# EAGLE design WarmDirt (EAGLE 5.11)
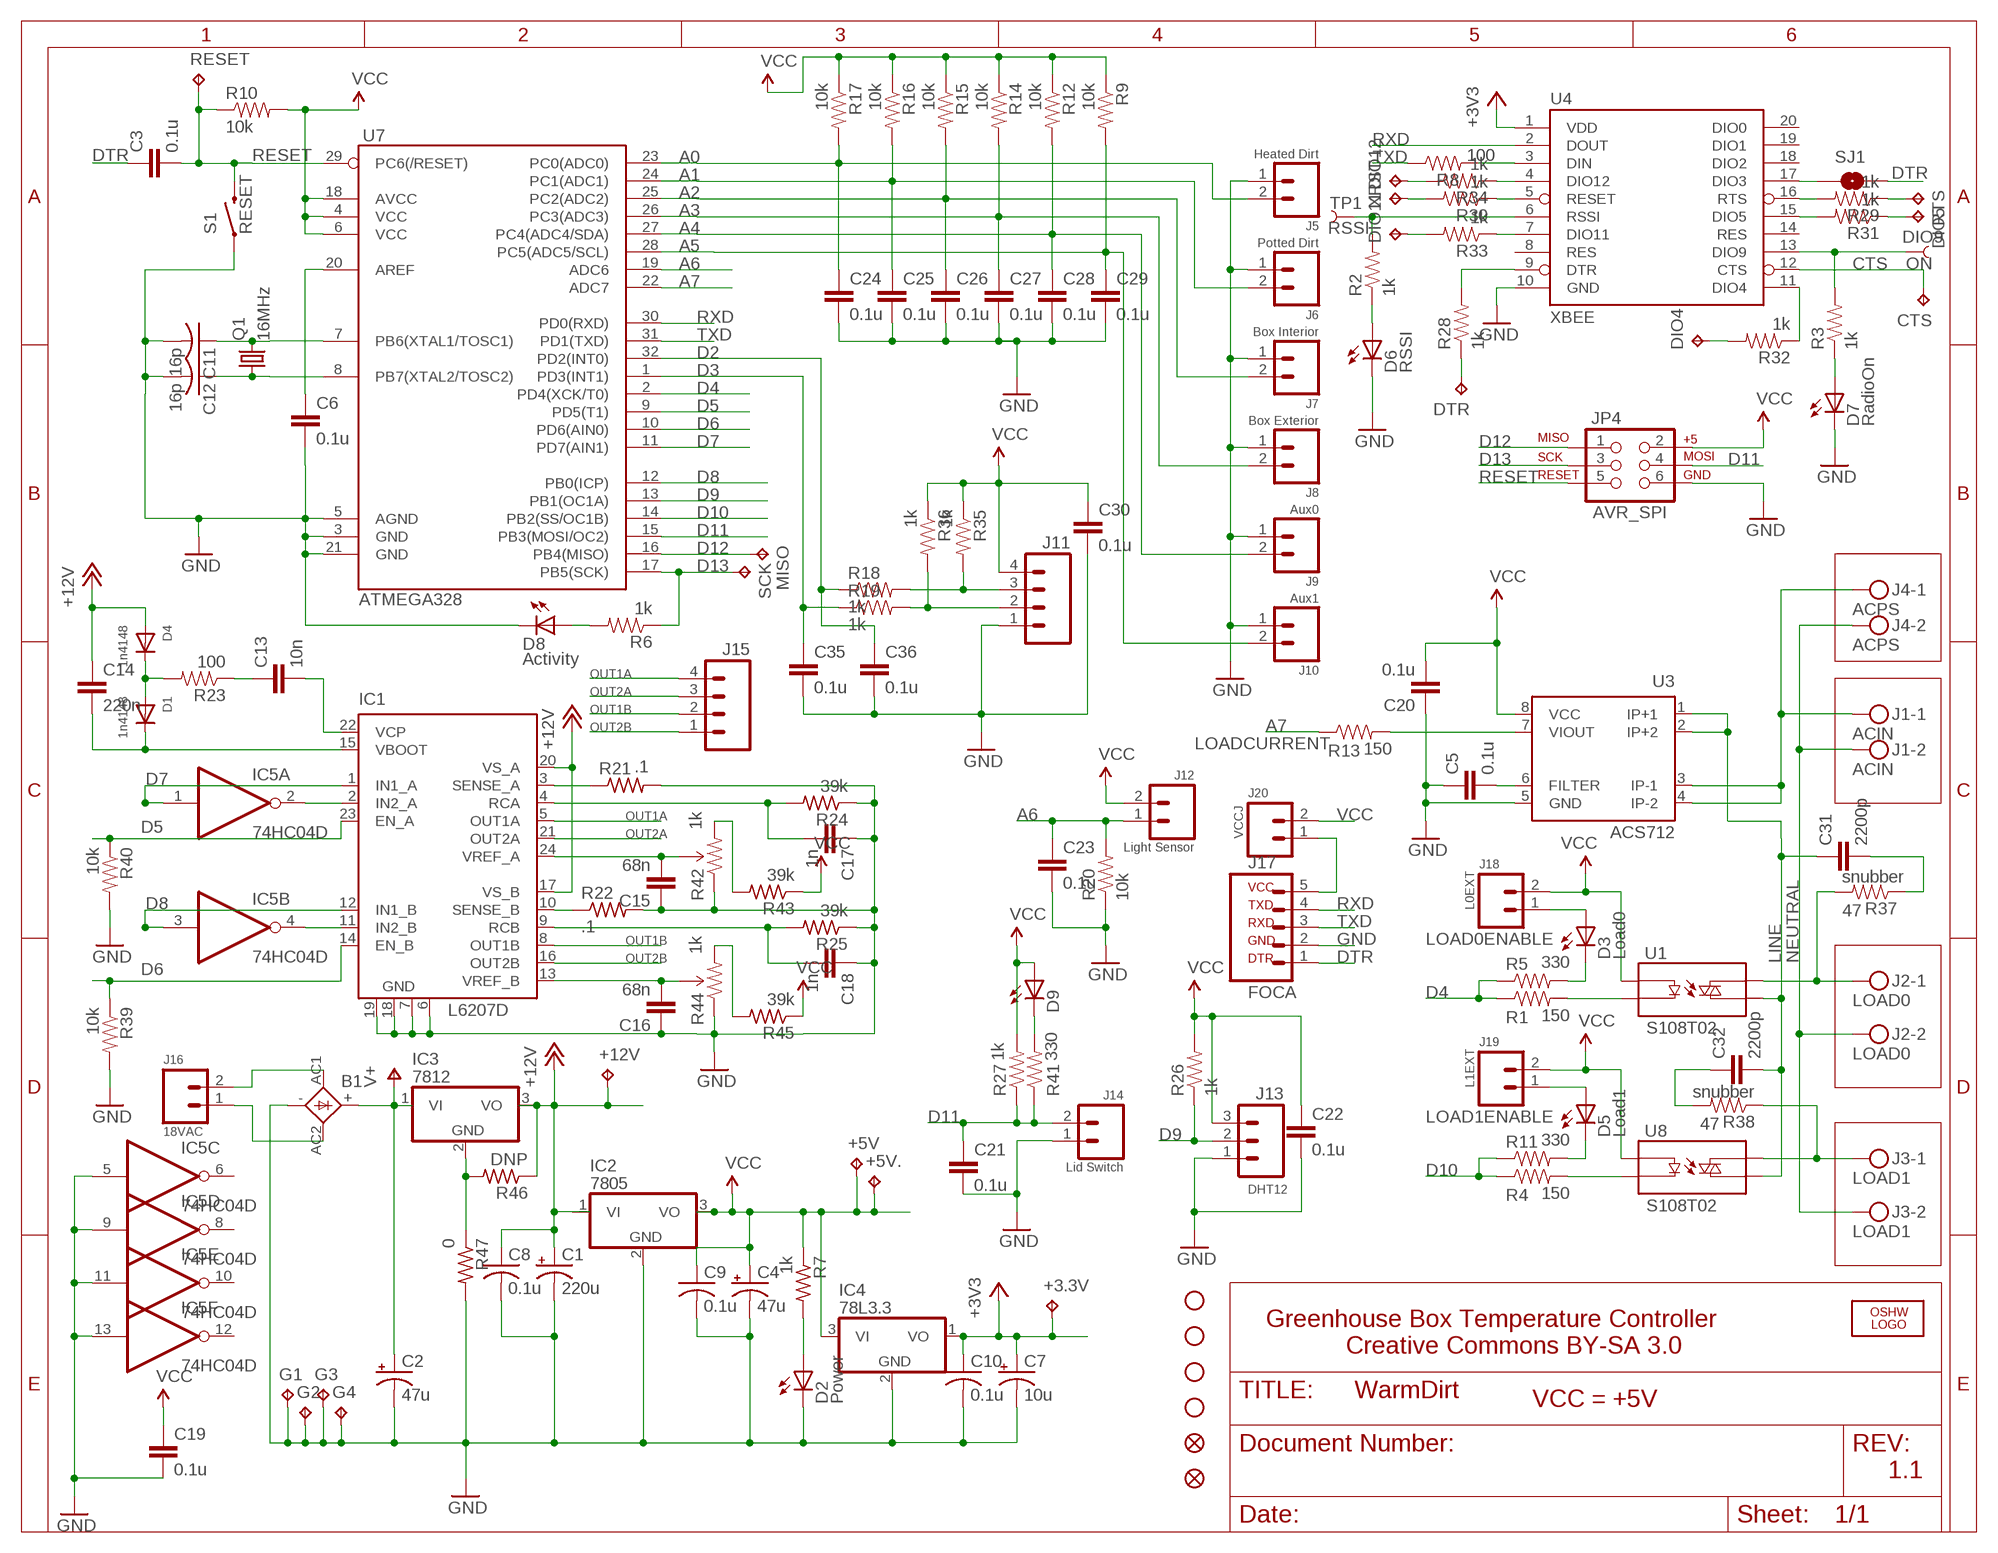
[diagram p0: schematic, sheet 1]

## Parts
+3.3V  TPPAD1-13  [P1-13]
+5V  TPPAD1-13  [P1-13]
+5V.  TPPAD1-13  [P1-13]
+12V  TPPAD1-13  [P1-13]
B1  2KBP  [2KBP]
C1  220u  CPOL-USE3.5-10  [E3,5-10]
C2  47u  CPOL-USE3.5-10  [E3,5-10]
C3  0.1u  CAP0603-CAP  [0603-CAP]
C4  47u  CPOL-USE3.5-10  [E3,5-10]
C5  0.1u  CAP0603-CAP  [0603-CAP]
C6  0.1u  CAP0603-CAP  [0603-CAP]
C7  10u  CPOL-USE2.5-5  [E2,5-5]
C8  0.1u  C-USC0603  [C0603]
C9  0.1u  C-USC0603  [C0603]
C10  0.1u  C-USC0603  [C0603]
C11  16p  C-USC0603  [C0603]
C12  16p  C-USC0603  [C0603]
C13  10n  CAP0603-CAP  [0603-CAP]
C14  220n  CAP0603-CAP  [0603-CAP]
C15  68n  CAP0603-CAP  [0603-CAP]
C16  68n  CAP0603-CAP  [0603-CAP]
C17  1n  CAP0603-CAP  [0603-CAP]
C18  1n  CAP0603-CAP  [0603-CAP]
C19  0.1u  CAP0603-CAP  [0603-CAP]
C20  0.1u  CAP0603-CAP  [0603-CAP]
C21  0.1u  CAP0603-CAP  [0603-CAP]
C22  0.1u  CAP0603-CAP  [0603-CAP]
C23  0.1u  CAP0603-CAP  [0603-CAP]
C24  0.1u  CAP0603-CAP  [0603-CAP]
C25  0.1u  CAP0603-CAP  [0603-CAP]
C26  0.1u  CAP0603-CAP  [0603-CAP]
C27  0.1u  CAP0603-CAP  [0603-CAP]
C28  0.1u  CAP0603-CAP  [0603-CAP]
C29  0.1u  CAP0603-CAP  [0603-CAP]
C30  0.1u  CAP0603-CAP  [0603-CAP]
C31  2200p  CAP0805  [0805]
C32  2200p  CAP0805  [0805]
C35  0.1u  CAP0603-CAP  [0603-CAP]
C36  0.1u  CAP0603-CAP  [0603-CAP]
CTS  TPPAD1-13  [P1-13]
D1  1n4148  DIODESOD-323  [SOD-323]
D2  Power  LEDCHIP-LED0603  [CHIP-LED0603]
D3  Load0  LEDCHIP-LED0603  [CHIP-LED0603]
D4  1n4148  DIODESOD-323  [SOD-323]
D5  Load1  LEDCHIP-LED0603  [CHIP-LED0603]
D6  RSSI  LEDCHIP-LED0603  [CHIP-LED0603]
D7  RadioOn  LEDCHIP-LED0603  [CHIP-LED0603]
D8  Activity  LEDCHIP-LED0603  [CHIP-LED0603]
D9  LEDCHIP-LED0603  [CHIP-LED0603]
DIO4  TPPAD1-13  [P1-13]
DIO5  TPPAD1-13  [P1-13]
DIO9  ON  TEST-POINT3X5  [PAD.03X.05]
DIO11  TPPAD1-13  [P1-13]
DIO12  TPPAD1-13  [P1-13]
DTR  TPPAD1-13  [P1-13]
G1  TPPAD1-13  [P1-13]
G2  TPPAD1-13  [P1-13]
G3  TPPAD1-13  [P1-13]
G4  TPPAD1-13  [P1-13]
IC1  L6207D  [SO24W]
IC2  7805  7805TV  [TO220V]
IC3  7812  7812TV  [TO220V]
IC4  78L3.3  78L05Z  [TO92]
IC5  74HC04D  [SO14]
J1  ACIN  1729128  [MKDSN1,5/2-5,08]
J2  LOAD0  1729128  [MKDSN1,5/2-5,08]
J3  LOAD1  1729128  [MKDSN1,5/2-5,08]
J4  ACPS  1729128  [MKDSN1,5/2-5,08]
J5  Heated Dirt  1984617  [1984617]
J6  Potted Dirt  1984617  [1984617]
J7  Box Interior  1984617  [1984617]
J8  Box Exterior  1984617  [1984617]
J9  Aux0  1984617  [1984617]
J10  Aux1  1984617  [1984617]
J11  Motor Encoder  1984633  [1984633]
J12  Light Sensor  1984617  [1984617]
J13  DHT12  1984620  [1984620]
J14  Lid Switch  1984617  [1984617]
J15  Motor  1984633  [1984633]
J16  18VAC  1984617  [1984617]
J17  FOCA2.1  [FOCA2.1]
J18  L0EXT  M02  [1X02]
J19  L1EXT  M02  [1X02]
J20  VCCJ  M02  [1X02]
JP1  FIDUCIAL1X2  [FIDUCIAL-1X2]
JP2  STAND-OFF  [STAND-OFF]
JP3  STAND-OFF  [STAND-OFF]
JP4  AVR_SPI  AVR_SPI_PRG_62X3_LOCK  [2X3_LOCK]
JP5  STAND-OFF  [STAND-OFF]
JP6  STAND-OFF  [STAND-OFF]
JP7  FIDUCIAL1X2  [FIDUCIAL-1X2]
LOGO1  OSHW_LOGO_FILLX0200-NT  [OSHW_FILLX200_NOTEXT]
MISO  TPPAD1-13  [P1-13]
Q1  16MHz  CRYSTALHC49UP  [HC49UP]
R1  150  RESISTOR0603-RES  [0603-RES]
R2  1k  RESISTOR0603-RES  [0603-RES]
R3  1k  RESISTOR0603-RES  [0603-RES]
R4  150  RESISTOR0603-RES  [0603-RES]
R5  330  RESISTOR0603-RES  [0603-RES]
R6  1k  RESISTOR0603-RES  [0603-RES]
R7  1k  R-US_R0603  [R0603]
R8  100  RESISTOR0603-RES  [0603-RES]
R9  10k  RESISTOR0603-RES  [0603-RES]
R10  10k  RESISTOR0603-RES  [0603-RES]
R11  330  RESISTOR0603-RES  [0603-RES]
R12  10k  RESISTOR0603-RES  [0603-RES]
R13  150  RESISTOR0603-RES  [0603-RES]
R14  10k  RESISTOR0603-RES  [0603-RES]
R15  10k  RESISTOR0603-RES  [0603-RES]
R16  10k  RESISTOR0603-RES  [0603-RES]
R17  10k  RESISTOR0603-RES  [0603-RES]
R18  1k  RESISTOR0603-RES  [0603-RES]
R19  1k  RESISTOR0603-RES  [0603-RES]
R20  10k  RESISTOR0603-RES  [0603-RES]
R21  .1  R-US_R1210  [R1210]
R22  .1  R-US_R1210  [R1210]
R23  100  RESISTOR0603-RES  [0603-RES]
R24  39k  R-US_R0603  [R0603]
R25  39k  R-US_R0603  [R0603]
R26  1k  RESISTOR0603-RES  [0603-RES]
R27  1k  RESISTOR0603-RES  [0603-RES]
R28  1k  RESISTOR0603-RES  [0603-RES]
R29  1k  RESISTOR0603-RES  [0603-RES]
R30  1k  RESISTOR0603-RES  [0603-RES]
R31  1k  RESISTOR0603-RES  [0603-RES]
R32  1k  RESISTOR0603-RES  [0603-RES]
R33  1k  RESISTOR0603-RES  [0603-RES]
R34  1k  RESISTOR0603-RES  [0603-RES]
R35  1k  RESISTOR0603-RES  [0603-RES]
R36  1k  RESISTOR0603-RES  [0603-RES]
R37  47  RESISTOR0603-RES  [0603-RES]
R38  47  RESISTOR0603-RES  [0603-RES]
R39  10k  RESISTOR0603-RES  [0603-RES]
R40  10k  RESISTOR0603-RES  [0603-RES]
R41  330  RESISTOR0603-RES  [0603-RES]
R42  1k  TRIMPOTSMD  [TRIMPOT-3MM]
R43  39k  R-US_R0603  [R0603]
R44  1k  TRIMPOTSMD  [TRIMPOT-3MM]
R45  39k  R-US_R0603  [R0603]
R46  DNP  R-US_R0603  [R0603]
R47  0  R-US_R0603  [R0603]
RESET  TPPAD1-13  [P1-13]
RTS  TPPAD1-13  [P1-13]
S1  RESET  SWITCH-PUSHBUTTON  [TACTILE-SWITCH-6MMX3.5MM]
SCK  TPPAD1-13  [P1-13]
SJ1  SOLDERJUMPERNC  [SJ_2S]
TP1  RSSI  TEST-POINT3X5  [PAD.03X.05]
U1  S108T02  S108T02PTH  [RELAY-S108T02]
U3  ACS712  [SOIC08]
U4  XBEE  XBEE-1B3  [XBEE-SMD]
U7  ATMEGA328  ATMEGA168  [TQFP32-08]
U8  S108T02  S108T02PTH  [RELAY-S108T02]
XRST  TPPAD1-13  [P1-13]

## Nets
+3V3 [VCC]: +3.3V.TP C7.+ C10.1 IC4.1(VO) U4.1(VDD)
+12V: +12V.TP C1.+ C8.1 C14.1 D4.A IC1.17(VS_B) IC1.20(VS_A) IC2.1(VI) IC3.3(VO) R46.1
A0: C24.1 J5.2 R17.2 U7.23(PC0(ADC0))
A1: C25.1 J6.2 R16.2 U7.24(PC1(ADC1))
A2: C26.1 J7.2 R15.2 U7.25(PC2(ADC2))
A3: C27.1 J8.2 R14.2 U7.26(PC3(ADC3))
A4: C28.1 J9.2 R12.2 U7.27(PC4(ADC4/SDA))
A5: C29.1 J10.2 R9.2 U7.28(PC5(ADC5/SCL))
A6: C23.1 J12.1 R20.2 U7.19(ADC6)
A7: R13.1 U7.22(ADC7)
AC1: J1.1 J4.1 U3.3(IP-1) U3.4(IP-2)
AC2: C31.1 C32.2 U1.2(T2) U3.1(IP+1) U3.2(IP+2) U8.2(T2)
AREF: C6.1 U7.20(AREF)
CTS: CTS.TP U4.12(CTS)
D2: C36.1 R18.1 U7.32(PD2(INT0))
D3: C35.1 R19.1 U7.1(PD3(INT1))
D4: R1.1 R5.1 U7.2(PD4(XCK/T0))
D5: IC1.23(EN_A) R40.1 U7.9(PD5(T1))
D6: IC1.14(EN_B) R39.1 U7.10(PD6(AIN0))
D7: IC1.1(IN1_A) IC5.1(A:I) U7.11(PD7(AIN1))
D8: IC1.12(IN1_B) IC5.3(B:I) U7.12(PB0(ICP))
D9: J13.2 R26.1 U7.13(PB1(OC1A))
D10: R4.1 R11.1 U7.14(PB2(SS/OC1B))
D11: C21.1 J14.2 JP4.4 R27.1 R41.1 U7.15(PB3(MOSI/OC2))
D12: JP4.1 MISO.TP U7.16(PB4(MISO))
D13: JP4.3 R6.1 SCK.TP U7.17(PB5(SCK))
DTR: C3.1 J17.1 SJ1.2
GND: B1.- C1.- C2.- C4.- C5.1 C6.2 C7.- C8.2 C9.2 C10.2 C11.2 C12.2 C15.1 C16.1 C17.1 C18.1 C19.2 C20.1 C21.2 C22.2 C23.2 C24.2 C25.2 C26.2 C27.2 C28.2 C29.2 C30.2 C35.2 C36.2 D2.C D6.C D7.C D8.C G1.TP G2.TP G3.TP G4.TP IC1.6(GND) IC1.7(GND) IC1.18(GND) IC1.19(GND) IC2.2(GND) IC4.2(GND) IC5.5(C:I) IC5.9(D:I) IC5.11(E:I) IC5.13(F:I) J5.1 J6.1 J7.1 J8.1 J9.1 J10.1 J11.1 J13.1 J14.1 J17.2 JP4.6 R20.1 R21.2 R22.2 R24.1 R25.1 R39.2 R40.2 R42.1(CCW) R44.1(CCW) R47.2 S1.P$1 U3.5(GND) U4.10(GND) U7.3(GND) U7.5(AGND) U7.21(GND)
N$1: D6.A R2.1
N$2: R2.2 TP1.P$1 U4.6(RSSI)
N$3: B1.AC1 J16.2
N$4: J2.1 R37.2 U1.1(T1)
N$5: D7.A R3.1
N$6: D5.A J19.1
N$7: DIO9.P$1 R3.2 U4.13(DIO9)
N$8: R8.2 U4.3(DIN)
N$9: D3.C R5.2
N$10: D8.A R6.2
N$11: B1.AC2 J16.1
N$12: D2.A R7.2
N$13: SJ1.1 U4.17(DIO3)
N$14: C11.1 Q1.2 U7.7(PB6(XTAL1/TOSC1))
N$15: C12.1 Q1.1 U7.8(PB7(XTAL2/TOSC2))
N$16: IC1.2(IN2_A) IC5.2(A:O)
N$17: IC1.11(IN2_B) IC5.4(B:O)
N$18: D1.A D4.C R23.2
N$19: J3.1 R38.1 U8.1(T1)
N$20: R1.2 U1.4(-)
N$21: J1.2 J2.2 J3.2 J4.2
N$22: IC1.3(SENSE_A) R21.1
N$23: D3.A J18.1
N$24: IC1.10(SENSE_B) R22.1
N$25: R4.2 U8.4(-)
N$26: D5.C R11.2
N$27: C5.2 U3.6(FILTER)
N$28: R13.2 U3.7(VIOUT)
N$29: C14.2 D1.C IC1.15(VBOOT)
N$30: J11.3 R18.2 R35.2
N$31: J11.2 R19.2 R36.2
N$32: C17.2 IC1.4(RCA) R24.2
N$33: C13.1 R23.1
N$34: C13.2 IC1.22(VCP)
N$35: C15.2 IC1.24(VREF_A) R42.2(WIPER)
N$36: C16.2 IC1.13(VREF_B) R44.2(WIPER)
N$37: C18.2 IC1.9(RCB) R25.2
N$39: DTR.TP R28.1
N$40: R29.2 U4.16(RTS)
N$41: R29.1 RTS.TP
N$42: R30.2 XRST.TP
N$43: R30.1 U4.5(RESET)
N$44: DIO12.TP R34.2
N$45: R34.1 U4.4(DIO12)
N$46: R33.1 U4.7(DIO11)
N$47: DIO11.TP R33.2
N$48: R31.2 U4.15(DIO5)
N$49: DIO5.TP R31.1
N$50: R32.1 U4.11(DIO4)
N$51: DIO4.TP R32.2
N$71: C31.2 R37.1
N$92: C32.1 R38.2
N$93: IC3.2(GND) R46.2 R47.1
N$94: D9.C R41.2
N$95: J17.5 J20.1
N$103: R42.3(CW) R43.2
N$104: R44.3(CW) R45.2
OUT1A: IC1.5(OUT1A) J15.4
OUT1B: IC1.8(OUT1B) J15.2
OUT2A: IC1.21(OUT2A) J15.3
OUT2B: IC1.16(OUT2B) J15.1
RESET: C3.2 JP4.5 R10.1 RESET.TP S1.P$2 U7.29(PC6(/RESET))
RXD: J17.4 U4.2(DOUT) U7.30(PD0(RXD))
SLEEP_RQ: R28.2 U4.9(DTR)
TXD: J17.3 R8.1 U7.31(PD1(TXD))
V+: B1.+ C2.+ IC3.1(VI)
VCC: +5V..TP +5V.TP C4.+ C9.1 C19.1 C20.2 C22.1 C30.1 D9.A IC2.3(VO) IC4.3(VI) J11.4 J12.2 J13.3 J18.2 J19.2 J20.2 JP4.2 R7.1 R9.1 R10.2 R12.1 R14.1 R15.1 R16.1 R17.1 R26.2 R27.2 R35.1 R36.1 R43.1 R45.1 U1.3(+) U3.8(VCC) U7.4(VCC) U7.6(VCC) U7.18(AVCC) U8.3(+)
Unconnected: IC5.6(C:O) IC5.8(D:O) IC5.10(E:O) IC5.12(F:O) U4.8(RES) U4.14(RES) U4.18(DIO2) U4.19(DIO1) U4.20(DIO0)

## Notes on the sheet
- LOADCURRENT
- snubber
- LOAD0ENABLE
- LINE | NEUTRAL
- snubber
- LOAD1ENABLE
- DHT12
- Greenhouse Box Temperature Controller
- Creative Commons BY-SA 3.0
- VCC = +5V
- 1.1

## Power pins joined to a net without a drawn wire
GND: IC5.7(P:GND)
VCC: IC5.14(P:VCC)

## Library data of the parts
+3.3V +5V +5V. +12V CTS DIO4 DIO5 DIO11 DIO12 DTR G1-G4 MISO RESET RTS SCK XRST = testpad:TP: Test pad
B1 = rectifier:2KBP: RECTIFIER grid 3 x 3,81 mm
C1 C2 C4 C7 = rcl:CPOL-US: POLARIZED CAPACITOR, American symbol
C3 C5 C6 C13-C32 C35 C36 = SparkFun:CAP: Capacitor Standard 0603 ceramic capacitor, and 0.1" leaded capacitor.
C8-C12 = rcl:C-US: CAPACITOR, American symbol
D1 D4 = adafruit-2a72e41:DIODE: Diode SMADIODE - SMA Surface Mount Package 20V 1A Schottky Diode Digikey: 641-1014-6-ND DO-1N4148 - Through Hole Small Current Diode SOD-123 20V 1 A (.5mV Vf) Schottky Diode - Digikey: MBRX120TPMSCT-ND SOD-323 10V 570mA (.38mV Vf, 3ns) Schottky Diode - Digikey: ZLLS410CT-ND SOD-523 30V 30mA Schottky Diode (RB751S-40TE61) - Digikey: RB751S-40TE61CT-ND SOT23-R/W - SOT23 Package (R = Solder Paste/Reflow Ovens, W = Hand-Soldering) BAT54Film 40V 300mA - Digikey: 497-7162-1-ND
D2 D3 D5-D9 = led:LED: LED OSRAM: - CHIPLED LG R971, LG N971, LY N971, LG Q971, LY Q971, LO R971, LY R971 LH N974, LH R974 LS Q976, LO Q976, LY Q976 LO Q996 - Hyper CHIPLED LW Q18S LB Q993, LB Q99A, LB R99A - SideLED LS A670, LO A670, LY A670, LG A670, LP A670 LB A673, LV A673, LT A673, LW A673 LH A674 LY A675 LS A676, LA A676, LO A676, LY A676, LW A676 LS A679, LY A679, LG A679 - Hyper Micro SIDELED® LS Y876, LA Y876, LO Y876, LY Y876 LT Y87S - SmartLED LW L88C, LW L88S LB L89C, LB L89S, LG L890 LS L89K, LO L89K, LY L89K LS L896, LA L896, LO L896, LY L896 - TOPLED LS T670, LO T670, LY T670, LG T670, LP T670 LSG T670, LSP T670, LSY T670, LOP T670, LYG T670 LG T671, LOG T671, LSG T671 LB T673, LV T673, LT T673, LW T673 LH T674 LS T676, LA T676, LO T676, LY T676, LB T676, LH T676, LSB T676, LW T676 LB T67C, LV T67C, LT T67C, LS T67K, LO T67K, LY T67K, LW E67C LS E67B, LA E67B, LO E67B, LY E67B, LB E67C, LV E67C, LT E67C LW T67C LS T679, LY T679, LG T679 LS T770, LO T770, LY T770, LG T770, LP T770 LB T773, LV T773, LT T773, LW T773 LH T774 LS E675, LA E675, LY E675, LS T675 LS T776, LA T776, LO T776, LY T776, LB T776 LHGB T686 LT T68C, LB T68C - Hyper Mini TOPLED® LB M676 - Mini TOPLED Santana® LG M470 LS M47K, LO M47K, LY M47K Source: http://www.osram.convergy.de LUXEON: - LUMILED® LXK2-PW12-R00, LXK2-PW12-S00, LXK2-PW14-U00, LXK2-PW14-V00 LXK2-PM12-R00, LXK2-PM12-S00, LXK2-PM14-U00 LXK2-PE12-Q00, LXK2-PE12-R00, LXK2-PE12-S00, LXK2-PE14-T00, LXK2-PE14-U00 LXK2-PB12-K00, LXK2-PB12-L00, LXK2-PB12-M00, LXK2-PB14-N00, LXK2-PB14-P00, LXK2-PB14-Q00 LXK2-PR12-L00, LXK2-PR12-M00, LXK2-PR14-Q00, LXK2-PR14-R00 LXK2-PD12-Q00, LXK2-PD12-R00, LXK2-PD12-S00 LXK2-PH12-R00, LXK2-PH12-S00 LXK2-PL12-P00, LXK2-PL12-Q00, LXK2-PL12-R00 Source: www.luxeon.com KINGBRIGHT: KA-3528ASYC Source: www.kingbright.com
DIO9 TP1 = SparkFun:TEST-POINT
IC1 = st-microelectronics:L6207: DUAL DMOS FULL BRIDGE MOTOR DRIVER; MPN: L6207D; OC_FARNELL: unknown; OC_NEWARK: 42M9976
IC2-IC4 = linear:78*: Positive VOLTAGE REGULATOR Source: http://cache.national.com/ds/LM/LM78L05.pdf http://www.fairchildsemi.com/ds/LM/LM7805.pdf
IC5 = 74xx-eu:74*04: Hex INVERTER
J1-J4 = brightleaf:1729128: Phoenix Contact CONN TERM BLOCK 3POS 5.08MM PCB Printklemme Nennstrom: 13,5 A Nennspannung: 250 V Rastermaß: 5,08 mm Polzahl: 2 Anschlussart: Schraubanschluss Montage: Löten Anschlussrichtung Leiter/Platine: 0 ° Artikelnummer: 1729128 Source: http://eshop.phoenixcontact.com .. 1729128.pdf; MPN: MKDSN 1,5/2-5.08; OC_FARNELL: 1792903; OC_NEWARK: 30M2397
J5-J10 J12 J14 J16 = brightleaf:1984617: Phoenix Contact CONN TERM BLOCK T/H 2POS 3.5MM
J11 J15 = brightleaf:1984633: Phoenix Contact CONN TERM BLOCK T/H 4POS 3.5MM
J13 = brightleaf:1984620: Phoenix Contact CONN TERM BLOCK T/H 3POS 3.5MM
J17 = brightleaf:FOCA2.1: FOCA 2.1 iteadstudio Foca v2.1 Foca is a FT232RL breakout. The FT232RL is a USB to serial UART interface with optional clock generator output. It?s the essential tools for establishing communication between PC and mostly MCU. Especially, it?s the optimum tool for the board which basic Arduino but without USB interface,like Sniffer Nano , Colorduino and etc.
J18-J20 = brightleaf:M02
JP1 JP7 = SparkFun:FIDUCIAL: Fiducial Alignment Points Various fiducial points for machine vision alignment.
JP2 JP3 JP5 JP6 = SparkFun:STAND-OFF: Stand Off This is the mechanical footprint for a #4 phillips button head screw. Use the keepout ring to avoid running the screw head into surrounding components. SKU : PRT-00447
JP4 = SparkFun:AVR_SPI_PRG_6: AVR ISP 6 Pin This is the reduced ISP connector for AVR programming. Common on Arduino. This footprint will take up less PCB space and can be used with a 10-pin to 6-pin adapter such as SKU: BOB-08508
LOGO1 = ohw-logo:OSHW_LOGO_FILL
Q1 = crystal:CRYSTAL: CRYSTAL; OC_FARNELL: unknown; OC_NEWARK: unknown
R1-R6 R8-R20 R23 R26-R41 = SparkFun:RESISTOR: Resistor Basic schematic elements and footprints for 0603, 1206, and PTH resistors.
R7 = resistor:R-US_: RESISTOR, American symbol
R21 R22 R24 R25 R43 R45-R47 = rcl:R-US_: RESISTOR, American symbol
R42 R44 = SparkFun:TRIMPOT
S1 = brightleaf:SWITCH-PUSHBUTTON
SJ1 = SparkFun:SOLDERJUMPER: Solder Jumper Standard SMD solder jumper. Used to automate production. Two varients : Normally Open and Normally Closed are the same, but have different paste layers. NC will have a large amount of paste and should jumper during reflow.
U1 U8 = brightleaf:S108T02
U3 = brightleaf:ACS712: Fully Integrated, Hall Effect-Based Linear Current Sensor IC with 2.1 kVRMS Isolation and a Low-Resistance Current Conductor
U4 = SparkFun:XBEE-1
U7 = SparkFun:ATMEGA168

## Net classes
0 default: width 0.203 mm
1 VCC: width 0.381 mm

## Board
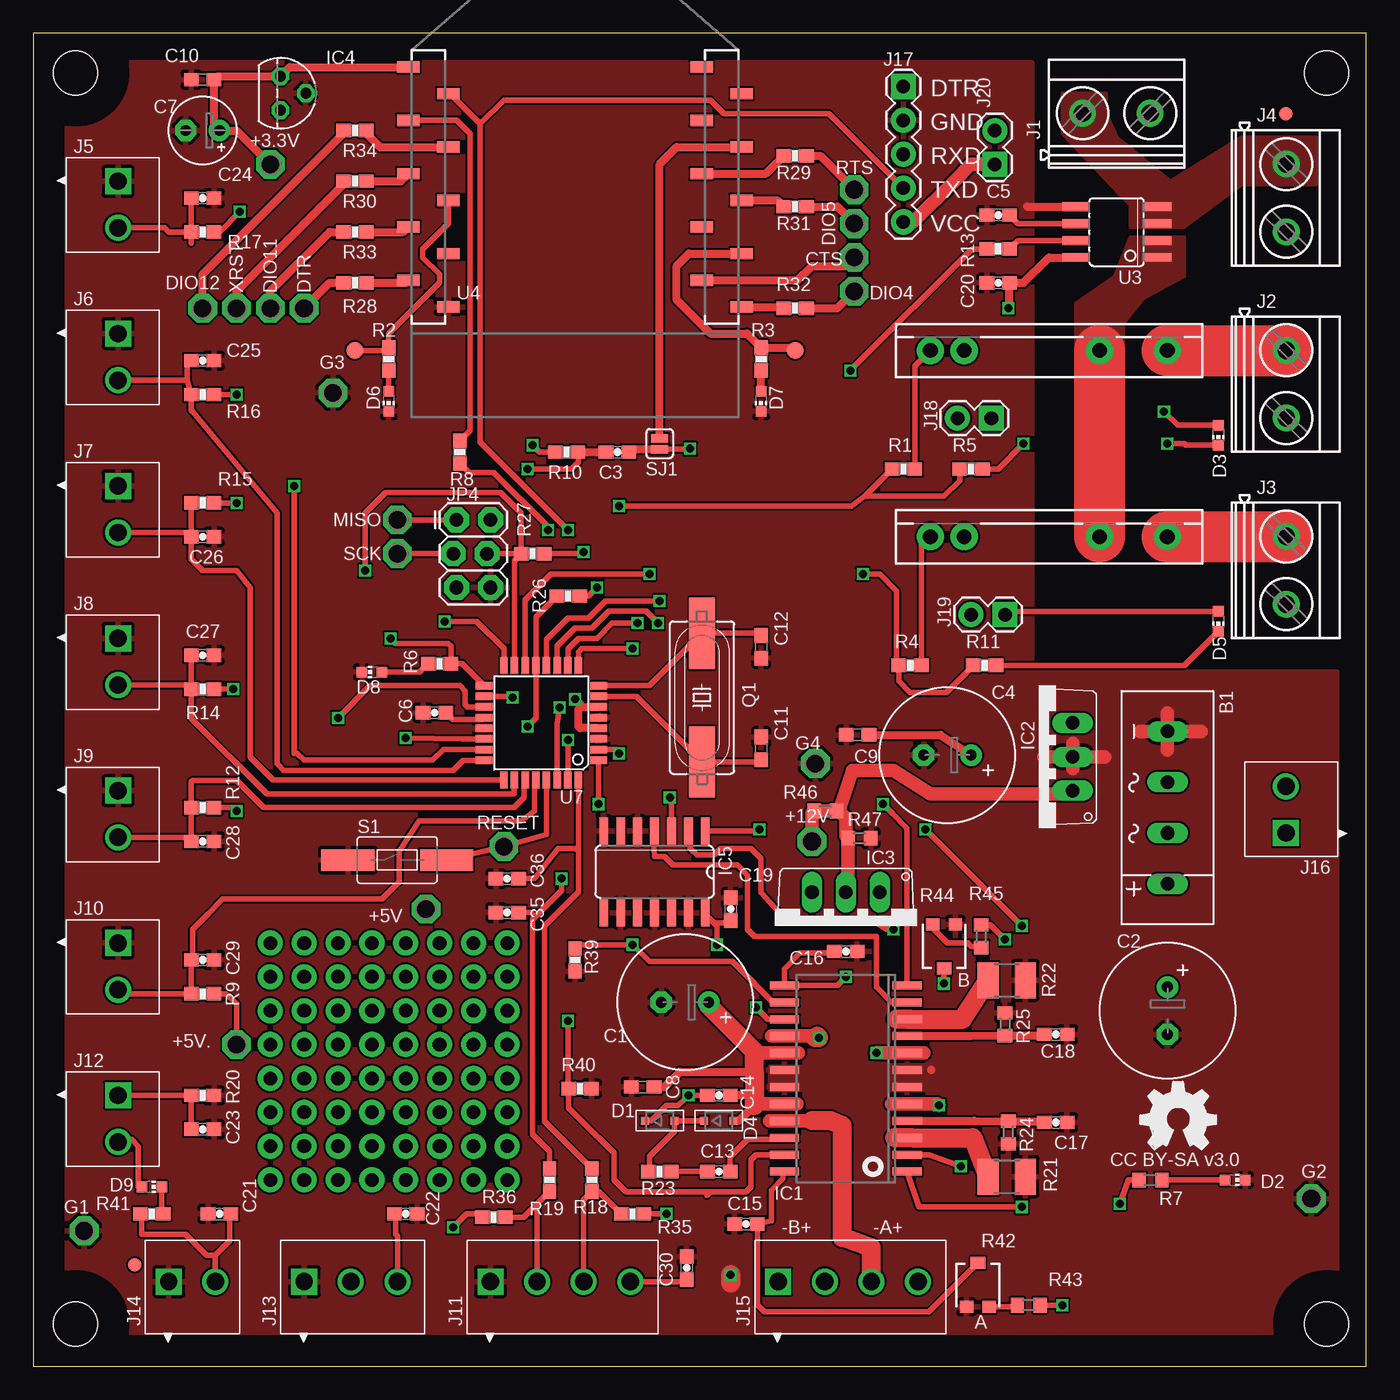
[diagram p1: board, top side]
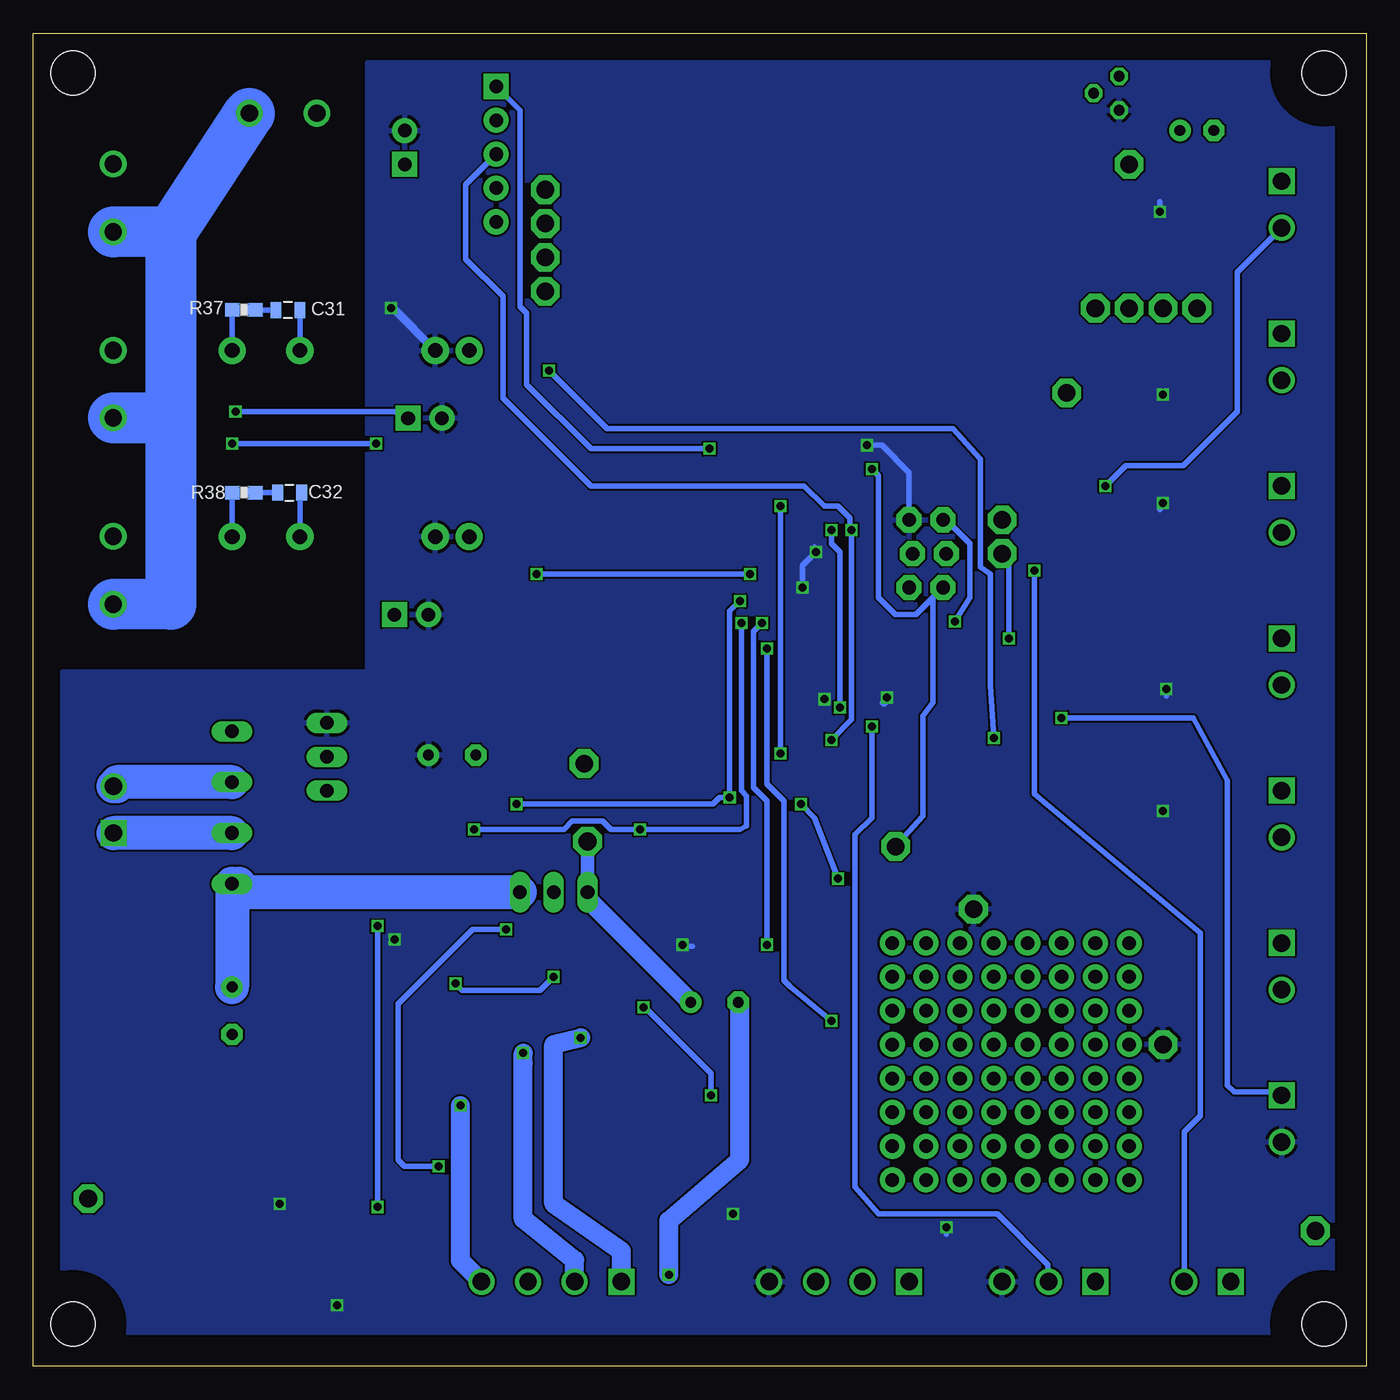
[diagram p2: board, bottom side, seen from below]

Size 100 x 100 mm. Coordinates in mm from the lower left corner, seen from the top.
Outline: 0,0 100,0 100,100 0,100 0,0
Copper layers (1*16): Top 0.035mm / dielectric 1.5mm / Bottom 0.035mm
Design rules "ITead_rule": minimum track width 6mil, minimum drill 12mil, track to track 6mil, track to pad 6mil, pad to pad 6mil, via to via 6mil, smd to smd 0mil, copper to edge 10mil, drill to drill 10mil, minimum pad ring 10mil, minimum via ring 6mil, stop-mask expansion 2mil, vias tented up to drill 100mil, thermal gap 10mil
tKeepout: area 93.2,93.2 to 100.8,100.8
tRestrict: area 34.5,44.7 to 41.7,51.8; area 93.2,-0.6 to 100.8,7; area -0.6,-0.6 to 7,7; area -0.6,93.2 to 7,100.8
bRestrict: area 93.2,-0.6 to 100.8,7; area -0.6,-0.6 to 7,7; area -0.6,93.2 to 7,100.8

### Footprints (pad centres in the part's own frame; a part is rotated, then mirrored left to right if it is on the bottom)
P1-13 = drill 1.321 pad 2.159 octagon: TP 0,0
2KBP = drill 1.016 long: + 5.715,0; - -5.715,0; AC1 -1.905,0; AC2 1.905,0
E3,5-10 = drill 0.813 pad 1.6 round: + -1.778,0 | drill 0.813 pad 1.6 octagon: - 1.778,0
0603-CAP = smd 1.1 x 1: 1 -0.85,0; 2 0.85,0
E2,5-5 = drill 0.813 pad 1.6 round: + -1.27,0 | drill 0.813 pad 1.6 octagon: - 1.27,0
C0603 = smd 1.1 x 1: 1 -0.85,0; 2 0.85,0
0805 = smd 0.8 x 1.2: 1 -0.9,0; 2 0.9,0
SOD-323 = smd 0.6 x 0.6: A 1.1,0; C -1.1,0
CHIP-LED0603 = smd 0.8 x 0.8: A 0,-0.75; C 0,0.75
PAD.03X.05 = smd 1.27 x 1.27: P$1 0,0
SO24W = smd 0.6 x 2.2: 1 -6.985,-4.6; 2 -5.715,-4.6; 3 -4.445,-4.6; 4 -3.175,-4.6; 5 -1.905,-4.6; 6 -0.635,-4.6; 7 0.635,-4.6; 8 1.905,-4.6; 9 3.175,-4.6; 10 4.445,-4.6; 11 5.715,-4.6; 12 6.985,-4.6; 13 6.985,4.6; 14 5.715,4.6; 15 4.445,4.6; 16 3.175,4.6; 17 1.905,4.6; 18 0.635,4.6; 19 -0.635,4.6; 20 -1.905,4.6; 21 -3.175,4.6; 22 -4.445,4.6; 23 -5.715,4.6; 24 -6.985,4.6
TO220V = drill 1.016 long: 1 -2.54,-2.54; 2 0,-2.54; 3 2.54,-2.54
TO92 = drill 0.813 octagon: 1 -1.27,0; 2 0,1.905; 3 1.27,0
SO14 = smd 0.66 x 2.032: 1 -3.81,-3.073; 2 -2.54,-3.073; 3 -1.27,-3.073; 4 0,-3.073; 5 1.27,-3.073; 6 2.54,-3.073; 7 3.81,-3.073; 8 3.81,3.073; 9 2.54,3.073; 10 1.27,3.073; 11 0,3.073; 12 -1.27,3.073; 13 -2.54,3.073; 14 -3.81,3.073
MKDSN1,5/2-5,08 = drill 1.3 pad 2 round: 1 -2.561,0.025; 2 2.519,0.025
1984617 = drill 1.3 square: 1 0,0 | drill 1.3 round: 2 3.5,0
1984633 = drill 1.3 square: 1 0,0 | drill 1.3 round: 2 3.5,0; 3 7,0; 4 10.5,0
1984620 = drill 1.3 square: 1 0,0 | drill 1.3 round: 2 3.5,0; 3 7,0
FOCA2.1 = drill 1.016 pad 1.88 square: 1 0,0 | drill 1.016 pad 1.88 round: 2 2.54,0; 3 5.08,0; 4 7.62,0; 5 10.16,0
1X02 = drill 1.016 pad 1.88 square: 1 0,0 | drill 1.016 pad 1.88 round: 2 2.54,0
FIDUCIAL-1X2 = smd 1 x 1: 1 0,0
STAND-OFF = hole 3.302: 0,0
2X3_LOCK = drill 1.016 pad 1.88 octagon: 1 0,0; 2 0,2.54; 3 2.54,-0.254; 4 2.54,2.286; 5 5.08,0; 6 5.08,2.54
HC49UP = smd 5.334 x 1.93: 1 -4.826,0; 2 4.826,0
0603-RES = smd 1.1 x 1: 1 -0.85,0; 2 0.85,0
R0603 = smd 1 x 1.1: 1 -0.85,0; 2 0.85,0
R1210 = smd 1.6 x 2.7: 1 -1.4,0; 2 1.4,0
TRIMPOT-3MM = smd 1 x 0.9: 1 -0.85,-1.65; 3 0.85,-1.65 | smd 1.1 x 0.9: 2 0,1.65
TACTILE-SWITCH-6MMX3.5MM = smd 4 x 1.6: P$1 -3.7,0; P$2 3.7,0
SJ_2S = smd 0.635 x 1.27: 1 -0.412,0; 2 0.412,0
RELAY-S108T02 = drill 1.1 pad 2.032 round: 1 -8.88,0; 2 -3.8,0; 3 6.36,0; 4 8.9,0
SOIC08 = smd 0.66 x 2.032: 1 -1.905,-3.073; 2 -0.635,-3.073; 3 0.635,-3.073; 4 1.905,-3.073; 5 1.905,3.073; 6 0.635,3.073; 7 -0.635,3.073; 8 -1.905,3.073
XBEE-SMD = smd 1.7 x 0.85: 1 -12.5,20; 2 -9.5,18; 3 -12.5,16; 4 -9.5,14; 5 -12.5,12; 6 -9.5,10; 7 -12.5,8; 8 -9.5,6; 9 -12.5,4; 10 -9.5,2; 11 12.5,2; 12 9.5,4; 13 12.5,6; 14 9.5,8; 15 12.5,10; 16 9.5,12; 17 12.5,14; 18 9.5,16; 19 12.5,18; 20 9.5,20
TQFP32-08 = smd 1.27 x 0.559: 1 -4.293,2.8; 2 -4.293,2; 3 -4.293,1.2; 4 -4.293,0.4; 5 -4.293,-0.4; 6 -4.293,-1.2; 7 -4.293,-2; 8 -4.293,-2.8; 17 4.293,-2.8; 18 4.293,-2; 19 4.293,-1.2; 20 4.293,-0.4; 21 4.293,0.4; 22 4.293,1.2; 23 4.293,2; 24 4.293,2.8 | smd 0.559 x 1.27: 9 -2.8,-4.293; 10 -2,-4.293; 11 -1.2,-4.293; 12 -0.4,-4.293; 13 0.4,-4.293; 14 1.2,-4.293; 15 2,-4.293; 16 2.8,-4.293; 25 2.8,4.293; 26 2,4.293; 27 1.2,4.293; 28 0.4,4.293; 29 -0.4,4.293; 30 -1.2,4.293; 31 -2,4.293; 32 -2.8,4.293

### Placement (x,y rotation side)
+3.3V  17.78,90.17 0 top
+5V  29.46,34.29 0 top
+5V.  15.24,24.13 0 top
+12V  58.42,39.37 0 top
B1  85.09,41.91 270 top
C1  48.9,27.3 180 top
C2  85.09,26.67 270 top
C3  43.81,68.58 180 top
C4  68.58,45.85 180 top
C5  72.39,86.36 0 top
C6  30.1,49.02 180 top
C7  12.7,92.71 180 top
C8  45.72,20.95 180 top
C9  61.85,47.37 180 top
C10  12.7,96.52 180 top
C11  54.61,46.35 90 top
C12  54.61,53.98 270 top
C13  51.44,14.61 0 top
C14  51.44,20.32 180 top
C15  53.47,10.67 0 top
C16  60.96,31.11 180 top
C17  76.71,18.29 180 top
C18  76.71,24.89 180 top
C19  52.32,34.29 90 top
C20  72.39,81.28 0 top
C21  13.97,11.43 180 top
C22  27.94,11.43 0 top
C23  12.7,17.78 0 top
C24  12.7,87.63 0 top
C25  12.7,75.44 0 top
C26  12.7,62.23 0 top
C27  12.7,53.34 0 top
C28  12.7,39.37 0 top
C29  12.7,30.48 0 top
C30  49.02,7.37 90 top
C31  80.9,79.25 180 bottom
C32  80.77,65.53 0 bottom
C35  35.56,34.04 180 top
C36  35.56,36.58 180 top
CTS  61.59,83.19 90 top
D1  46.99,18.41 0 top
D2  90.17,13.97 270 top
D3  88.9,69.85 180 top
D4  51.44,18.41 0 top
D5  88.9,55.88 180 top
D6  26.67,72.39 180 top
D7  54.61,72.39 180 top
D8  25.4,52.07 90 top
D9  8.89,13.46 270 top
DIO4  61.59,80.64 90 top
DIO5  61.59,85.72 90 top
DIO9  57.15,76.2 0 top
DIO11  17.78,79.38 90 top
DIO12  12.7,79.38 90 top
DTR  20.32,79.38 180 top
G1  3.81,10.16 0 top
G2  95.89,12.57 0 top
G3  22.48,73.03 0 top
G4  58.67,45.21 0 top
IC1  60.96,21.59 90 top
IC2  75.44,45.72 90 top
IC3  60.96,33.02 180 top
IC4  18.54,95.5 270 top
IC5  46.61,37.08 180 top
J1  81.28,93.98 0 top
J2  93.98,73.66 270 top
J3  93.98,59.69 270 top
J4  93.98,87.63 270 top
J5  6.35,88.9 270 top
J6  6.35,77.47 270 top
J7  6.35,66.04 270 top
J8  6.35,54.61 270 top
J9  6.35,43.18 270 top
J10  6.35,31.75 270 top
J11  34.29,6.35 0 top
J12  6.35,20.32 270 top
J13  20.32,6.35 0 top
J14  10.16,6.35 0 top
J15  55.88,6.35 0 top
J16  93.98,40.01 90 top
J17  65.28,96.01 270 top
J18  71.88,71.12 180 top
J19  72.9,56.39 180 top
J20  72.14,90.17 90 top
JP1  7.62,7.62 0 top
JP2  97.03,97.03 0 top
JP3  97.03,3.17 0 top
JP4  31.75,63.5 270 top
JP5  3.17,97.03 0 top
JP6  3.17,3.17 0 top
JP7  93.98,93.98 0 top
LOGO1  83.06,16.26 0 top
MISO  27.3,63.5 0 top
Q1  50.16,50.16 270 top
R1  65.28,67.31 0 top
R2  26.67,75.56 90 top
R3  54.61,75.56 90 top
R4  65.79,52.58 0 top
R5  70.36,67.31 0 top
R6  30.48,52.7 180 top
R7  83.82,13.97 0 top
R8  32,68.58 90 top
R9  12.7,27.94 180 top
R10  40.01,68.58 180 top
R11  71.37,52.58 0 top
R12  12.7,41.91 180 top
R13  72.39,83.82 0 top
R14  12.7,50.8 180 top
R15  12.7,64.77 180 top
R16  12.7,72.9 180 top
R17  12.7,85.09 180 top
R18  41.91,13.97 270 top
R19  38.73,13.97 270 top
R20  12.7,20.32 180 top
R21  73.03,14.22 0 top
R22  73.03,28.96 0 top
R23  46.99,14.61 180 top
R24  73.15,17.53 90 top
R25  72.9,25.65 270 top
R26  40.13,57.78 0 top
R27  37.47,60.96 0 top
R28  24.13,81.28 0 top
R29  57.15,90.81 180 top
R30  24.13,88.9 180 top
R31  57.15,87 180 top
R32  57.15,79.38 0 top
R33  24.13,85.09 180 top
R34  24.13,92.71 180 top
R35  44.96,11.43 180 top
R36  34.54,11.18 0 top
R37  84.2,79.25 180 bottom
R38  84.2,65.53 0 bottom
R39  40.64,30.48 270 top
R40  41.02,20.83 0 top
R41  8.89,11.43 0 top
R42  70.87,6.1 0 top
R43  74.68,4.57 180 top
R44  68.33,31.5 180 top
R45  71.12,32.26 270 top
R46  59.44,41.66 0 top
R47  61.98,39.62 0 top
RESET  35.31,38.99 0 top
RTS  61.59,88.27 270 top
S1  27.3,37.97 0 top
SCK  27.3,60.96 0 top
SJ1  46.99,69.22 270 top
TP1  24.13,76.2 0 top
U1  76.2,76.2 180 top
U3  81.28,85.09 90 top
U4  40.64,77.47 0 top
U7  38.1,48.26 180 top
U8  76.2,62.23 180 top
XRST  15.24,79.38 180 top

### Tracks (layer width: path | path; a pad name or v marks a point on that pad's centre or on a via)
+3V3
  Top 0.61: U4.1 19.24,97.47 IC4.1 13.8,96.77 C10.1 13.55,93.13 C7.+ 15.24,92.71 +3.3V.TP
+12V
  Top 0.406: 58.42,41.49 R46.1
  Top 0.61: 54.1,20.32 C14.1 | D4.A 52.96,18.41 54.1,19.56 | C8.1 47.37,20.95 48.51,22.1 54.1,22.1
  Top 1.016: 54.23,19.68 56.26,19.68 | 56.26,19.68 IC1.20 | 54.23,23.5 56.01,23.5 | 56.01,23.5 IC1.17 | 56.01,23.5 57.4,23.5 | 56.26,19.68 57.28,19.68 | +12V.TP 58.42,41.49 | R46.1 60.45,41.66 61.47,44.7 64.52,44.7 67.31,42.93 77.72,42.93 IC2.1
  Top 1.422: C1.+ 50.67,27.05 53.59,24.13 54.1,23.62 54.1,23.37 | 54.1,19.81 54.1,19.56 | 54.1,19.81 54.1,20.32 54.1,22.1 54.1,23.37 | 54.1,19.81 54.23,19.68 | 54.1,23.37 54.23,23.5
  Bottom 1.016: IC3.3 +12V.TP
  Bottom 1.422: IC3.3 58.42,35.05 C1.+
A0  (via drill 0.6)
  Top 0.406: U7.23 30.77,46.26 29.97,45.47 20.32,45.47 19.81,45.97 19.56,45.97 v19.56,66.04 | J5.2 9.85,85.4 10.16,85.09 R17.2 | R17.2 C24.1 | R17.2 11.85,84.24
  Bottom 0.406: v19.56,66.04 18.03,67.56 13.72,67.56 9.65,71.63 9.65,82.1 J5.2
A1
  Top 0.406: U7.24 32.25,45.46 31.5,44.7 18.8,44.7 18.29,45.21 18.29,64.01 11.94,71.63 11.85,71.72 R16.2 11.54,73.97 | 11.54,73.97 J6.2 | 11.54,73.97 11.54,75.38 C25.1
A2
  Top 0.406: U7.25 18.01,43.97 16.26,45.72 16.26,58.42 15.24,59.69 12.7,59.69 11.85,60.54 C26.1 | J7.2 11.54,62.54 C26.1 | C26.1 R15.2
A3
  Top 0.406: U7.26 36.07,43.94 36.07,42.93 17.53,42.93 11.85,48.6 R14.2 | J8.2 11.54,51.11 R14.2 | R14.2 C27.1
A4
  Top 0.406: U7.27 36.83,43.9 36.83,42.67 36.07,41.91 19.05,41.91 17.27,41.91 15.24,43.94 11.94,43.94 11.85,43.85 R12.2 C28.1 11.54,39.68 J9.2
A5
  Top 0.406: U7.28 37.59,43.86 37.59,41.66 36.58,40.89 28.96,40.89 27.43,38.61 27.43,36.32 26.16,35.05 14.22,35.05 13.12,33.95 11.94,32.77 11.94,30.57 C29.1 R9.2 6.66,27.94 J10.2
A6  (via drill 0.6)
  Top 0.406: U7.19 32.58,49.46 32.38,49.66 32.38,50.67 32,51.05 25.27,51.05 v22.86,48.64 | J12.1 R20.2 C23.1
  Bottom 0.406: v22.86,48.64 12.95,48.64 10.41,43.94 10.41,21.59 10.41,21.08 9.91,20.57 6.6,20.57 J12.1
A7  (via drill 0.6)
  Top 0.406: R13.1 70.41,83.82 61.62,75.03 | 61.62,75.03 v61.29,74.7 61.62,75.03 | U7.22 32.19,47.06 v27.94,47.12
  Bottom 0.406: v27.94,47.12 28.19,51.05 28.19,59.44 28.96,59.94 28.96,68.07 30.99,70.36 56.95,70.36 v61.29,74.7
AC1
  pour Top (no thermals): 82.3,85.47 86.36,85.47 90.68,88.65 96.27,88.65 96.27,92.2 90.68,92.2 85.34,88.9 81.28,92.2 80.52,93.98 80.52,95.5 77.22,95.5 77.22,92.46 81.53,87.88 82.3,87.12
AC2
  Top 3.81: U8.2 U1.2
  Bottom 0.406: C31.1 U1.2 | C32.2 80,65.53 U8.2
  pour Top (no thermals): 78.23,74.93 78.23,79.76 81.15,81.79 82.3,84.71 86.36,84.71 86.36,81.79 83.31,80.14 81.79,78.23 81.79,74.93
AREF
  Top 0.406: U7.20 33.66,48.51 31.46,48.51 C6.1
CTS
  Top 0.61: U4.12 57.34,81.47 58.42,82.55 60.96,82.55 CTS.TP
D2
  Top 0.406: 40.9,38.61 40.9,35.57 38.35,33.02 38.36,18.37 R18.1 | 40.9,38.61 U7.32 | C36.1 37.59,36.58 39.37,38.86 40.65,38.86 40.9,38.61
D3  (via drill 0.6)
  Top 0.406: R19.1 38.73,16.13 37.47,17.4 37.47,33.53 37.66,33.72 | 37.66,33.72 39.62,35.69 v39.62,36.58 | v42.42,42.16 42.42,45.44 U7.1 | C35.1 37.34,34.04 37.66,33.72
  Bottom 0.406: v39.62,36.58 41.4,41.15 v42.42,42.16
D4  (via drill 0.6)
  Top 0.406: U7.2 43.72,46.26 v43.94,45.97 | v43.94,64.52 61.3,64.52 61.38,64.52 62.44,65.32 | 62.44,65.32 R1.1 | R5.1 69.51,66.46 68.33,65.28 62.48,65.28 62.44,65.32
  Bottom 0.406: v43.94,45.97 v43.94,64.52
D5  (via drill 0.6)
  Top 0.406: U7.9 40.9,53.6 41.15,53.85 42.67,53.85 43.18,53.85 v44.96,53.85 | v40.13,25.91 40.13,22.95 40.13,20.87 R40.1 40.17,19.39 41.15,18.41 43.56,16 43.56,13.97 44.45,13.08 50.8,13.08 | 50.8,13.08 53.47,13.08 53.85,13.46 53.85,15.49 54.23,15.88 IC1.23 | 50.8,13.08 50.55,12.83
  Bottom 0.406: v44.96,53.85 44.96,43.69 43.69,42.42 43.69,28.96 43.18,28.45 v40.13,25.91
D6  (via drill 0.6)
  Top 0.406: U7.10 40.1,53.82 40.89,54.61 42.29,54.61 43.43,55.75 43.56,55.75 v45.34,55.75 | IC1.14 55.5,27.3 52.7,30.1 52.45,30.35 46.23,30.35 v44.96,31.62 42.04,31.62 40.64,31.62 R39.1
  Bottom 0.406: v44.96,31.62 44.96,42.42 45.97,43.43 45.97,55.12 v45.34,55.75
D7  (via drill 0.6)
  Top 0.406: U7.11 39.3,54.03 40.64,55.37 41.91,55.37 43.18,56.64 45.97,56.64 v46.86,55.75 | IC5.1 54.33,40.16 v54.48,40.26 | v66.93,40.26 68.58,38.61 v74.17,33.02 | v74.17,11.94 66.45,11.94 IC1.1
  Bottom 0.406: v66.93,40.26 60.2,40.26 59.56,40.89 57.28,40.89 56.64,40.26 v54.48,40.26 46.99,40.26 46.48,40.51 46.48,42.8 46.86,43.18 46.86,54.74 | v74.17,33.02 74.17,14.22 v74.17,11.94 | 46.86,54.74 v46.86,55.75 46.86,54.74
D8  (via drill 0.6)
  Top 0.406: U7.12 38.5,54.5 39.12,55.12 40.13,56.13 41.66,56.13 42.93,57.4 v46.99,57.4 | IC5.3 47.88,42.55 v47.75,42.67 | IC1.12 65.56,40.36 64.45,41.47 | 64.45,41.47 v63.75,42.16 64.45,41.47
  Bottom 0.406: v46.99,57.4 47.75,56.64 v47.75,42.67 48.51,42.67 49.02,42.16 v63.75,42.16
D9  (via drill 0.6)
  Top 0.406: R26.1 37.7,56.2 U7.13 37.7,48.62 v37.08,48.01
  Bottom 0.406: v37.08,48.01 37.08,41.15 38.35,39.88 38.35,13.46 36.58,11.43 27.69,11.43 23.88,7.62 23.88,6.41 J13.2
D10  (via drill 0.6)
  Top 0.406: U7.14 36.9,57.47 38.86,59.44 v46.23,59.44 | R11.1 68.49,50.55 65.79,50.55 64.94,51.4 R4.1 64.77,52.74 64.77,58.17 63.5,59.44 v62.23,59.44
  Bottom 0.406: v46.23,59.44 v62.23,59.44
D11  (via drill 0.6)
  Top 0.406: U7.15 36.1,55.12 36.1,60.45 R27.1 | R27.1 JP4.4 | v24.89,59.69 24.89,64.01 26.42,65.53 35.05,65.53 36.58,64.01 36.58,61 R27.1 | 13.66,8.33 J14.2 | 13.66,8.33 14.73,9.4 14.73,11.34 C21.1 | 13.66,8.33 13.01,8.33 11.43,9.91 8.13,9.91 8.13,11.34 R41.1
  Bottom 0.406: J14.2 13.66,17.58 12.45,18.8 12.45,32.51 23.5,41.78 24.89,42.93 v24.89,59.69
D12  (via drill 0.6)
  Top 0.406: JP4.1 MISO.TP | v30.86,55.88 33.27,55.88 35.31,53.85 U7.16
  Bottom 0.406: JP4.1 31.5,63.5 29.72,61.72 29.72,57.66 v30.86,55.88
D13  (via drill 0.6)
  Top 0.406: U7.17 32.16,52.7 R6.1 31.33,54.01 31.11,54.23 27.18,54.23 v26.8,54.61 | SCK.TP JP4.3
  Bottom 0.406: v26.8,54.61 26.8,60.45 SCK.TP
DTR  (via drill 0.6)
  Top 0.406: SJ1.2 49.24,68.8 v49.28,68.83
  Top 0.61: SJ1.2 44.89,68.8 C3.1
  Bottom 0.406: v49.28,68.83 58.17,68.83 62.99,73.66 62.99,78.99 63.5,79.5 63.5,94.23 J17.1
GND  (via drill 0.6)
  Top 0.61: 74.55,87 U3.5 | 67.36,22.25 67.36,22.23
  Top 1.016: 83.06,47.62 87.63,47.62 | 85.09,46.23 85.09,49.02 | 75.82,45.72 80.39,45.72 | 77.98,44.83 77.98,46.74
  Top 1.422: v52.32,6.86 52.32,6.22
  Bottom 1.422: 46.99,27.3 46.99,15.62 46.99,15.49 52.32,10.92 v52.32,6.86
  pour Top: 2.54,2.54 2.54,97.79 74.93,97.79 74.93,52.07 97.79,52.07 97.79,2.54
  pour Top (no thermals): 55.24,22.48 57.91,22.48 57.91,20.7 55.24,20.7
  pour Top (no thermals): 63.88,22.61 67.31,22.61 67.31,20.7 63.88,20.7
N$1
  Top 0.406: D6.A R2.1
N$2
  Top 0.406: U4.6 31.14,85.75 29.21,83.82 29.21,83.19 30.48,81.92 30.48,81.28 29.21,80.01 26.67,77.47 R2.2 26.45,76.2 TP1.P$1
N$3
  Bottom 2.54: B1.AC1 93.73,43.81 93.73,43.51 J16.2
N$4
  Top 3.81: U1.1 93.98,76.2 J2.1
  Bottom 0.406: R37.2 85.08,79.25 U1.1
N$5
  Top 0.61: D7.A R3.1
N$6
  Top 0.406: D5.A 73.14,56.63 J19.1
N$7
  Top 0.61: U4.13 49.18,83.47 48.26,82.55 48.26,80.01 50.8,77.47 53.55,77.47 R3.2 56.94,76.42 DIO9.P$1
N$8
  Top 0.406: U4.3 31.75,93.47 32.77,92.46 32.77,70.19 R8.2
N$9  (via drill 0.6)
  Top 0.406: D3.C 88.89,69.09 86.49,69.09 86.36,69.22 v85.09,69.22 | R5.2 72.39,67.31 v74.3,69.22
  Bottom 0.406: v74.3,69.22 v85.09,69.22
N$10
  Top 0.406: D8.A 29,52.07 R6.2
N$11
  Bottom 2.54: B1.AC2 J16.1
N$12
  Top 0.406: R7.2 D2.A
N$13
  Top 0.61: U4.17 48.29,91.47 48.26,91.44 46.99,90.17 SJ1.1
N$14
  Top 0.406: U7.7 45.24,50.26 Q1.2 54.44,45.34 C11.1
N$15
  Top 0.406: U7.8 46.23,51.06 Q1.1 54.44,54.99 C12.1
N$16  (via drill 0.6)
  Top 0.406: IC1.2 67.18,15.88 v69.6,14.99 | v64.52,32.77 64.01,32.77 63.25,33.27 56.64,33.27 54.61,35.56 54.61,38.1 53.85,38.86 51.56,38.86 51.05,38.35 49.78,38.35 49.28,38.86 49.28,40.03 IC5.2
  Bottom 0.406: v69.6,14.99 72.14,14.99 72.64,15.49 72.64,27.18 67.06,32.77 v64.52,32.77
N$17
  Top 0.406: IC1.11 64.39,27.3 63.25,28.45 63.25,32.26 62.99,32.26 54.1,32.26 53.59,32.77 53.59,36.83 52.83,37.59 48.01,37.59 47.37,38.23 46.61,38.23 46.48,40.03 IC5.4
N$18
  Top 0.406: R23.2 46.23,14.69 46.23,15.75 48.09,17.61 D1.A D4.C
N$19
  Top 3.81: U8.1 J3.1
  Bottom 0.406: R38.1 85.08,65.53 U8.1
N$20
  Top 0.406: R1.2 66.13,75.03 U1.4
N$21
  Bottom 3.81: 89.66,71.12 J2.2 | 89.66,71.12 89.66,57.15 J3.2 | 89.66,85.09 J4.2 | 89.66,71.12 89.66,85.09 | 89.66,85.09 J1.2
N$22
  Top 0.813: IC1.3 65.91,17.14
  Top 1.422: R21.1 70.48,17.14 65.91,17.14 64.64,17.14
N$23  (via drill 0.6)
  Top 0.406: D3.A 85.86,70.6 v84.84,71.63
  Bottom 0.406: v84.84,71.63 72.9,71.63 J18.1
N$24
  Top 1.422: IC1.10 65.79,26.04 | 65.79,26.04 69.72,26.04 R22.1 | 65.79,26.04 64.77,26.04
N$25
  Top 0.406: R4.2 66.64,61.57 U8.4
N$26
  Top 0.406: R11.2 86.35,52.58 D5.C
  Top 0.61: D5.C 88.89,55.12
N$27
  Top 0.406: U3.6 73.88,85.72 C5.2
N$28
  Top 0.406: U3.7 73.88,84.45 R13.2
N$29  (via drill 0.6)
  Top 0.406: D1.C 46.35,18.41 47.5,19.56 48.39,19.56 48.9,20.07 v49.15,20.32 C14.2 | IC1.15 55.12,26.04 v54.23,26.92
  Bottom 0.406: v54.23,26.92 54.1,26.92 49.15,21.97 v49.15,20.32
N$30
  Top 0.406: J11.3 41.29,12.5 R18.2 42.42,13.12 R35.2
N$31
  Top 0.406: J11.2 37.79,12.18 38.33,12.72 | 38.33,12.72 R19.2 | R36.2 36.79,11.18 38.33,12.72
N$32
  Top 0.406: 75.86,18.38 C17.2
  Top 0.61: IC1.4 70.57,18.41 R24.2 75.86,18.38
N$33
  Top 0.406: R23.1 C13.1
N$34
  Top 0.406: C13.2 52.28,15.71 53.59,17.02 56.23,17.02 IC1.22
N$35
  Top 0.406: IC1.24 56.26,14.51 56.26,14.1 55.37,13.21 55.37,10.92 C15.2 54.32,4.61 54.86,4.06 67.18,4.06 R42.2
N$36  (via drill 0.6)
  Top 0.406: C16.2 59.98,30.99 57.53,30.99 56.36,29.82 IC1.13 60.33,28.57 v60.96,29.21 | v68.33,28.7 R44.2
  Bottom 0.406: v60.96,29.21 61.98,28.19 67.82,28.19 v68.33,28.7
N$37
  Top 0.406: 75.86,24.8 C18.2
  Top 0.61: IC1.9 70.32,24.77 R25.2 75.86,24.8
N$38  (via drill 1.02 pad 1.88)
  other vias: 30.48,29.21
N$39
  Top 0.61: R28.1 22.23,81.28 DTR.TP
N$40
  Top 0.61: U4.16 54.97,89.47 R29.2
N$41
  Top 0.61: R29.1 59.05,90.81 RTS.TP
N$42
  Top 0.61: R30.2 23.28,88.69 15.24,80.64 XRST.TP
N$43
  Top 0.61: R30.1 27.57,88.9 U4.5
N$44
  Top 0.61: R34.2 23.28,92.5 17.14,86.36 12.7,81.92 DIO12.TP
N$45
  Top 0.61: R34.1 24.98,92.5 26.04,91.44 31.11,91.44 U4.4
N$46
  Top 0.61: R33.1 27.76,85.09 U4.7
N$47
  Top 0.61: R33.2 22.23,85.09 17.78,80.64 DIO11.TP
N$48
  Top 0.61: U4.15 55.83,87.47 R31.2
N$49
  Top 0.61: R31.1 60.33,87 DIO5.TP
N$50
  Top 0.61: U4.11 56.2,79.47 R32.1
N$51
  Top 0.61: R32.2 60.33,79.38 DIO4.TP
N$52  (via drill 1.02 pad 1.88)
  other vias: 27.94,29.21
N$53  (via drill 1.02 pad 1.88)
  other vias: 25.4,29.21
N$54  (via drill 1.02 pad 1.88)
  other vias: 22.86,29.21
N$55  (via drill 1.02 pad 1.88)
  other vias: 20.32,29.21
N$56  (via drill 1.02 pad 1.88)
  other vias: 17.78,29.21
N$57  (via drill 1.02 pad 1.88)
  other vias: 35.56,13.97
N$58  (via drill 1.02 pad 1.88)
  other vias: 33.02,13.97
N$59  (via drill 1.02 pad 1.88)
  other vias: 35.56,16.51
N$60  (via drill 1.02 pad 1.88)
  other vias: 33.02,16.51
N$61  (via drill 1.02 pad 1.88)
  other vias: 35.56,19.05
N$62  (via drill 1.02 pad 1.88)
  other vias: 33.02,19.05
N$63  (via drill 1.02 pad 1.88)
  other vias: 35.56,21.59
N$64  (via drill 1.02 pad 1.88)
  other vias: 33.02,21.59
N$65  (via drill 1.02 pad 1.88)
  other vias: 35.56,24.13
N$66  (via drill 1.02 pad 1.88)
  other vias: 33.02,24.13
N$67  (via drill 1.02 pad 1.88)
  other vias: 35.56,26.67
N$68  (via drill 1.02 pad 1.88)
  other vias: 33.02,26.67
N$69  (via drill 1.02 pad 1.88)
  other vias: 35.56,29.21
N$70  (via drill 1.02 pad 1.88)
  other vias: 33.02,29.21
N$71
  Bottom 0.406: R37.1 C31.2
N$72  (via drill 1.02 pad 1.88)
  other vias: 30.48,31.75
N$73  (via drill 1.02 pad 1.88)
  other vias: 30.48,13.97
N$74  (via drill 1.02 pad 1.88)
  other vias: 27.94,13.97
N$75  (via drill 1.02 pad 1.88)
  other vias: 25.4,13.97
N$76  (via drill 1.02 pad 1.88)
  other vias: 22.86,13.97
N$77  (via drill 1.02 pad 1.88)
  other vias: 20.32,13.97
N$78  (via drill 1.02 pad 1.88)
  other vias: 17.78,13.97
N$79  (via drill 1.02 pad 1.88)
  other vias: 27.94,31.75
N$80  (via drill 1.02 pad 1.88)
  other vias: 25.4,31.75
N$81  (via drill 1.02 pad 1.88)
  other vias: 22.86,31.75
N$82  (via drill 1.02 pad 1.88)
  other vias: 20.32,31.75
N$83  (via drill 1.02 pad 1.88)
  other vias: 17.78,31.75
N$84  (via drill 1.02 pad 1.88)
  other vias: 35.56,31.75
N$85  (via drill 1.02 pad 1.88)
  other vias: 30.48,16.51
N$86  (via drill 1.02 pad 1.88)
  other vias: 27.94,16.51
N$87  (via drill 1.02 pad 1.88)
  other vias: 25.4,16.51
N$88  (via drill 1.02 pad 1.88)
  other vias: 22.86,16.51
N$89  (via drill 1.02 pad 1.88)
  other vias: 20.32,16.51
N$90  (via drill 1.02 pad 1.88)
  other vias: 17.78,16.51
N$91  (via drill 1.02 pad 1.88)
  other vias: 33.02,31.75
N$92
  Bottom 0.406: R38.2 C32.1
N$93
  Top 1.016: R46.2 60.45,41.66 60.96,41.15 60.96,39.79 R47.1 61.13,35.73 IC3.2
N$94
  Top 0.406: D9.C 9.64,11.53 R41.2
N$95
  Top 1.016: J17.5 66.04,85.85 69.09,88.9 70.36,90.17 J20.1
N$97  (via drill 1.02 pad 1.88)
  other vias: 30.48,19.05
N$98  (via drill 1.02 pad 1.88)
  other vias: 27.94,19.05
N$99  (via drill 1.02 pad 1.88)
  other vias: 25.4,19.05
N$100  (via drill 1.02 pad 1.88)
  other vias: 22.86,19.05
N$101  (via drill 1.02 pad 1.88)
  other vias: 20.32,19.05
N$102  (via drill 1.02 pad 1.88)
  other vias: 17.78,19.05
N$103
  Top 0.406: R42.3 73.7,4.45 R43.2
N$104
  Top 0.406: R44.3 67.48,32.85 68.58,31.75 70.1,31.75 70.36,31.5 71.03,31.5 R45.2
N$109  (via drill 1.02 pad 1.88)
  other vias: 30.48,21.59
N$110  (via drill 1.02 pad 1.88)
  other vias: 27.94,21.59
N$111  (via drill 1.02 pad 1.88)
  other vias: 25.4,21.59
N$112  (via drill 1.02 pad 1.88)
  other vias: 22.86,21.59
N$113  (via drill 1.02 pad 1.88)
  other vias: 20.32,21.59
N$114  (via drill 1.02 pad 1.88)
  other vias: 17.78,21.59
N$121  (via drill 1.02 pad 1.88)
  other vias: 30.48,24.13
N$122  (via drill 1.02 pad 1.88)
  other vias: 27.94,24.13
N$123  (via drill 1.02 pad 1.88)
  other vias: 25.4,24.13
N$124  (via drill 1.02 pad 1.88)
  other vias: 22.86,24.13
N$125  (via drill 1.02 pad 1.88)
  other vias: 20.32,24.13
N$126  (via drill 1.02 pad 1.88)
  other vias: 17.78,24.13
N$133  (via drill 1.02 pad 1.88)
  other vias: 30.48,26.67
N$134  (via drill 1.02 pad 1.88)
  other vias: 27.94,26.67
N$135  (via drill 1.02 pad 1.88)
  other vias: 25.4,26.67
N$136  (via drill 1.02 pad 1.88)
  other vias: 22.86,26.67
N$137  (via drill 1.02 pad 1.88)
  other vias: 20.32,26.67
N$138  (via drill 1.02 pad 1.88)
  other vias: 17.78,26.67
OUT1A  (via drill 0.6)
  Top 1.016: 65.91,19.68 IC1.5 | 65.91,19.68 67.82,19.68 v67.94,19.56 | 65.91,19.68 64.39,19.68
  Bottom 1.422: v67.94,19.56 67.94,7.92 J15.4
OUT1B  (via drill 0.6)
  Top 1.016: v63.25,23.5 65.02,23.5 | 65.02,23.5 IC1.8 | 65.02,23.5 66.8,23.5
  Bottom 1.422: J15.2 59.38,7.95 63.25,11.05 63.25,22.73 v63.25,23.5
OUT2A
  Top 1.016: IC1.21 56.52,18.41 56.64,18.41 | J15.3 62.87,6.37 | 58.42,18.41 56.64,18.41 | 56.64,18.41 55.24,18.41
  Top 1.422: 62.87,6.37 62.87,8.89 60.71,9.65 60.71,18.03 59.82,18.41 58.42,18.41
OUT2B  (via drill 0.6)
  Top 1.016: 58.8,24.77 56.64,24.77 | 56.64,24.77 IC1.16 | 56.64,24.77 55.37,24.77
  Top 1.422: 58.67,24.64 v58.93,24.64 58.8,24.77
  Bottom 1.422: J15.1 55.88,8.64 60.96,12.19 60.96,24.13 v58.93,24.64
RESET  (via drill 0.6)
  Top 0.406: U7.29 38.5,39.9 RESET.TP S1.P$2 | v37.08,67.31 40.39,67.31 40.89,67.82 40.89,68.54 R10.1
  Top 0.61: R10.1 C3.2
  Bottom 0.406: RESET.TP 33.27,41.27 33.27,48.77 32.51,49.78 32.51,50.04 32.51,51.31 32.51,57.66 JP4.5 33.78,56.39 35.31,56.39 36.58,57.66 36.58,66.8 v37.08,67.31
RXD  (via drill 0.6)
  Top 0.406: U4.2 31.28,95.47 33.53,93.22 | 33.53,93.22 33.53,69.34 37.08,65.79 v40.13,62.74 | v39.5,49.4 39.3,48.19 U7.30 | 33.53,93.22 35.31,95 50.8,95 51.82,93.98 59.69,93.98 J17.4
  Bottom 0.406: v39.5,49.4 39.5,61.09 40.13,61.72 v40.13,62.74
SLEEP_RQ
  Top 0.61: R28.2 27.95,81.28 U4.9
TXD  (via drill 0.6)
  Top 0.406: R8.1 32.68,67.06 34.54,67.06 38.61,62.99 v38.61,62.74 | v40.13,46.99 40.13,44 U7.31
  Bottom 0.406: v40.13,46.99 38.61,48.51 v38.61,62.74 38.73,62.87 38.73,63.63 39.62,64.52 39.88,64.52 40.64,64.52 42.16,66.04 58.17,66.04 64.77,72.64 64.77,80.26 67.56,83.06 67.56,88.65 J17.3
V+
  Bottom 2.54: B1.+ C2.+ | B1.+ 84.58,36.2 83.95,35.56 | IC3.1 84.45,35.56 B1.+
VCC  (via drill 0.6)
  Top 0.406: R7.1 82.17,13.97 v81.53,12.19 | R10.2 37.97,68.58 v37.47,69.09 | R27.2 41.15,60.96 v41.27,61.09 | R26.2 41.66,57.78 v42.29,58.42 | U7.18 35.85,50.26 v35.94,50.16 | IC5.14 50.42,33.91 51.05,33.27 | 51.05,33.27 52.16,33.27 C19.1 | R17.1 13.97,85.09 v15.49,86.61 | R16.1 v15.24,72.9 | R15.1 v15.24,64.77 | v14.99,50.8 R14.1 | R12.1 14.99,41.91 v15.24,41.66 | R9.1 14.48,27.94 15.24,27.18 +5V..TP | J13.3 27.32,9.76 27.18,9.91 27.18,11.34 C22.1 | 51.05,33.27 51.31,33.02 v51.31,31.62 | 44.79,6.52 J11.4 49.02,6.35 C30.1 | R35.1 v47.5,11.43 | v31.5,10.41 32.51,11.43 33.44,11.43 R36.1 | D9.A 7.87,13.46 7.87,16 7.87,16.51 7.37,17.02 6.55,17.02 J12.2 | R43.1 v77.22,4.57 | R45.1 71.79,33.11 v72.9,32
  Top 0.61: U3.8 76.2,83.19 74.3,81.28 C20.2 73.24,79.46 v73.15,79.38 | 41.08,49.46 U7.6 | 41.08,49.46 40.89,49.28 40.89,48.01 41.02,47.88 42.37,47.88 U7.4 | 41.08,49.46 41.08,49.6 v40.64,50.04 | C9.1 68.07,47.37 C4.+
  Bottom 0.406: 51.18,31.5 v51.31,31.62 51.18,31.5 | v37.47,69.09 36.32,69.09 34.29,67.06 JP4.2 | 41.4,61.47 41.27,61.34 v41.27,61.09 42.29,60.07 v42.29,58.42 | v35.94,50.16 35.94,50.04 36.2,49.78 | v15.49,86.61 15.49,87.38 | v15.24,72.9 15.49,72.9 | v15.24,64.77 15.24,64.52 15.49,64.26 | 14.99,50.29 v14.99,50.8 | v15.24,41.66 15.49,41.4 | 50.55,31.5 51.18,31.5 | v47.5,11.43 47.75,11.18 | 31.5,9.91 v31.5,10.41 | v77.22,4.57 77.47,4.57 | v72.9,32 72.9,31.75
  Bottom 0.61: v73.15,79.38 73.02,79.38 U1.3 | v40.64,50.04 40.51,50.16 | v35.94,50.16 35.94,50.04 36.2,49.78
  pour Bottom: 2.54,97.79 74.93,97.79 74.93,52.07 97.79,52.07 97.79,2.54 2.54,2.54

### Text on the board
tPlace: B | CC BY-SA v3.0 | A
tNames: -B+ | -A+
tValues: WarmDirt v1.1 | 111128 | Brightleaf Technologies | www.rethinksun.com